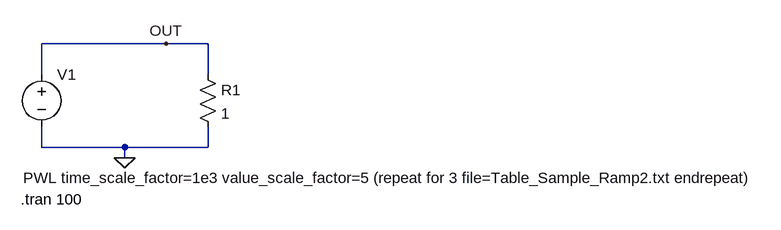
[diagram p0: schematic Fig_2-48_PWL_Scale_Table.asc]
Fig_2-48_PWL_Scale_Table.asc, the LTspice schematic file:
Version 4
SHEET 1 1680 680
WIRE 304 64 112 64
WIRE 368 64 304 64
WIRE 112 112 112 64
WIRE 368 112 368 64
WIRE 112 224 112 192
WIRE 240 224 112 224
WIRE 368 224 368 192
WIRE 368 224 240 224
WIRE 240 240 240 224
FLAG 240 240 0
FLAG 304 64 OUT
SYMBOL voltage 112 96 R0
WINDOW 3 -28 175 Left 2
WINDOW 123 0 0 Left 2
WINDOW 39 0 0 Left 2
SYMATTR Value PWL time_scale_factor=1e3 value_scale_factor=5 (repeat for 3 file=Table_Sample_Ramp2.txt endrepeat)
SYMATTR InstName V1
SYMBOL res 352 96 R0
SYMATTR InstName R1
SYMATTR Value 1
TEXT 80 304 Left 2 !.tran 100

The netlist it stands for:
* Fig_2-48_PWL_Scale_Table.asc
V1 OUT 0 PWL time_scale_factor=1e3 value_scale_factor=5 (repeat for 3 file=Table_Sample_Ramp2.txt endrepeat)
R1 OUT 0 1
.tran 100
.backanno
.end